# Altium schematic sheet 2_DS3231.SchDoc
size A; SheetNumber: 2; SheetTotal: 5
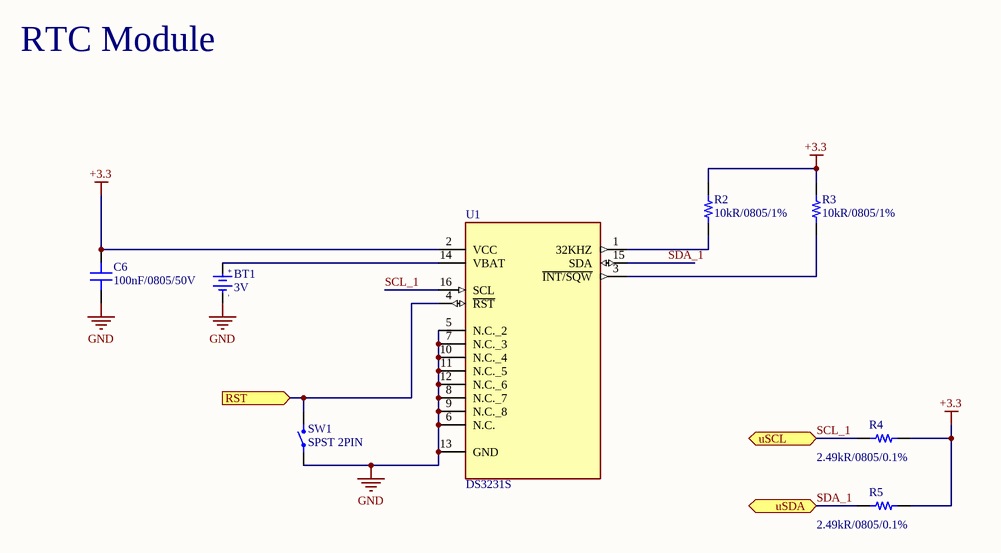
[diagram p0: 2_DS3231.SchDoc]

## Parts
BT1  3V  [PIN3V]
C6  100nF/0805/50V  [CAP FILM 0805]
R2  10kR/0805/1%  [RES 0805_2012]
R3  10kR/0805/1%  [RES 0805_2012]
R4  2.49kR/0805/0.1%  [RES 0805_2012]
R5  2.49kR/0805/0.1%  [RES 0805_2012]
SW1  SPST 2PIN  [3x4 SPST BUTTON]
U1  DS3231S  [SOIC127P1032X265-16N]

## Ports
RST (in), uSCL (bidir), uSDA (bidir)

## Nets
+3.3: C6.2 R2.2 R3.2 R4.1 R5.1 U1.2(VCC)
GND: BT1.2(GND) C6.1 SW1.1 U1.5(N.C._2) U1.6(N.C.) U1.7(N.C._3) U1.8(N.C._7) U1.9(N.C._8) U1.10(N.C._4) U1.11(N.C._5) U1.12(N.C._6) U1.13(GND)
RST: SW1.2 U1.4(~{RST}) ; port RST
SCL_1: R4.2 U1.16(SCL) ; port uSCL
SDA_1: R5.2 U1.15(SDA) ; port uSDA
NetBT1_1: BT1.1(+3V) U1.14(VBAT)
NetR2_1: R2.1 U1.1(32KHZ)
NetR3_1: R3.1 U1.3(~{INT/SQW})

## Notes on the sheet
- RTC Module
- (in symbol PIN 3V) +; -

## Library data of the parts
BT1 = PIN 3V: Battery 3VDC; Value: PIN 3V
C6 = Capacitor - MLCC: Multilayer Ceramic Capacitor, 0.1 uF, 50 V, ï¿½ 10%, X7R, 0805 [2012 Metric]; Manufacturer: Samsung; Manufacturer Part Number: CL21B104KBCNNNC; Capacitance: 100nF; Voltage Rating: 50V; Supplier 1: Avnet; Supplier Part Number 1: CL21B104KBCNNNC; RoHS: Yes; Category: Ceramic Capacitors; Stock 1: 850000; Pricing 1: 4000=0.0097, 8000=0.00455, 16000=0.00444, 24000=0.00434, 32000=0.00423 (USD); Mount: Surface Mount; Case/Package: 0805; Case Code (Metric): 2012; Case Code (Imperial): 0805; Material: Ceramic; Min Operating Temperature: -55°C; Max Operating Temperature: 125°C; Tolerance: 10%; Dielectric: X7R; Packaging: Tape and Reel; Voltage: 50V; Series: CL; Construction: Flat; Voltage Rating (DC): 50V; Length: 2mm; Width: 0.049inch; Height: 0.85mm; Depth: 1.25mm; Thickness: 0.037inch; Radiation Hardening: No; RoHS Compliant: Yes; Lead Free: 5697LeadFree; ComponentLink1URL: https://datasheet.ciiva.com/25710/cl21b104kbcnnnc-25710182.pdf?src-supplier=Digikey; ComponentLink1Description: https://datasheet.ciiva.com/25710/cl21b104kbcnnnc-25710182.pdf?src-supplier=Digikey; ComponentLink2URL: https://datasheet.ciiva.com/29199/454152-da-01-en-vs-kondensator-0805-29199814.pdf?src-supplier=Conrad; ComponentLink2Description: https://datasheet.ciiva.com/29199/454152-da-01-en-vs-kondensator-0805-29199814.pdf?src-supplier=Conrad
R2 R3 = Resistor: SMD Chip Resistor, 10 kOhm, ï¿½ 1%, 125 mW, 0805 [2012 Metric], Thick Film, General Purpose; Manufacturer: Yageo; Manufacturer Part Number: RC0805FR-0710KL; Resistance: 10kR; Temperature Coefficient: 100ppm/°C; Power Rating: 125mW; Voltage Rating: 150V; Supplier 1: Future Electronics; Supplier Part Number 1: 3310877; RoHS: Yes; Category: Chip SMD Resistors; Stock 1: 3290000; Pricing 1: 5000=0.0035, 25000=0.0034, 100000=0.0032, 250000=0.0032, 625000=0.003 (USD); Case/Package: 0805; Case Code (Imperial): 0805; Case Code (Metric): 2012; Size Code: 0805; Min Operating Temperature: -55°C; Max Operating Temperature: 155°C; Tolerance: 1%; Packaging: Tape and Reel; Resistor Type: Thick Film; Package Quantity: 1; Termination: SMD/SMT; Number of Terminations: 2; Max Power Dissipation: 125mW; Features: Moisture Resistant; Series: RC; Construction: Rectangular; Resistance Tolerance: 1%; Technology: THICK FILM; Length: 0.079inch; Width: 0.049inch; Height: 0.024inch; Depth: 1.25mm; Reach SVHC Compliant: Unknown; Lead Free: Lead Free; Military Standard: Not; RoHS Compliant: Yes
R4 R5 = Resistor: SMD Chip Resistor, High Precision, 2.49 kohm, ± 0.1%, 250 mW, 0805 [2012 Metric], Thick Film; Manufacturer: Panasonic; Manufacturer Part Number: ERJ-PB6B2491V; Resistance: 2.49kR; Max Power Dissipation: 250mW; Temperature Coefficient: 50ppm/°C; Voltage Rating (DC): 150V; Supplier 1: Mouser; Supplier Part Number 1: 667-ERJ-PB6B2491V; RoHS: Yes; Category: Chip SMD Resistors; Stock 1: 6524; Pricing 1: 1=0.36, 10=0.163, 50=0.163, 100=0.073, 1000=0.051, 10000=0.039 (USD); Case/Package: 0805; Case Code (Metric): 2012; Case Code (Imperial): 0805; Min Operating Temperature: -55°C; Max Operating Temperature: 155°C; Packaging: Cut Tape; Number of Terminations: 2; Tolerance: 0.1%; Features: Automotive AEC-Q200; Series: ERJ; Length: 0.079inch; Width: 0.049inch; Height - Seated (Max): 0.028inch; ComponentLink1URL: https://industrial.panasonic.com/cdbs/www-data/pdf/RDM0000/DMM0000COL5.pdf?src-supplier=Digikey; ComponentLink1Description: https://industrial.panasonic.com/cdbs/www-data/pdf/RDM0000/DMM0000COL5.pdf?src-supplier=Digikey; ComponentLink2URL: https://industrial.panasonic.com/cdbs/www-data/pdf/RDM0000/AOA0000C328.pdf?src-supplier=Digikey; ComponentLink2Description: https://industrial.panasonic.com/cdbs/www-data/pdf/RDM0000/AOA0000C328.pdf?src-supplier=Digikey
U1 = DS3231S: Real Time Clock (RTC) IC Clock/Calendar - IÂ²C, 2-Wire Serial 16-SOIC (0.295, 7.50mm Width); MF: Maxim Integrated; MP: DS3231S#; Value: *; Price: None; Package: SOIC-16 Maxim; Check_prices: https://www.snapeda.com/parts/DS3231S%23/Maxim+Integrated/view-part/?ref=eda; Availability: In Stock; SnapEDA_Link: https://www.snapeda.com/parts/DS3231S%23/Maxim+Integrated/view-part/?ref=snap; Purchase-URL: https://pricing.snapeda.com/search/part/DS3231S#/?ref=eda